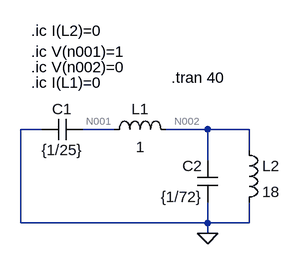
[diagram p0: schematic ej10.asc]
ej10.asc, the LTspice schematic file:
Version 4
SHEET 1 880 680
WIRE 80 176 48 176
WIRE 192 176 144 176
WIRE 336 176 272 176
WIRE 400 176 336 176
WIRE 400 208 400 176
WIRE 336 224 336 176
WIRE 48 320 48 176
WIRE 336 320 336 288
WIRE 336 320 48 320
WIRE 400 320 400 288
WIRE 400 320 336 320
WIRE 336 336 336 320
FLAG 336 336 0
SYMBOL ind 176 192 R270
WINDOW 0 32 56 VTop 2
WINDOW 3 5 56 VBottom 2
SYMATTR InstName L1
SYMATTR Value 1
SYMATTR SpiceLine Rser=0
SYMBOL cap 144 160 R90
WINDOW 0 0 32 VBottom 2
WINDOW 3 32 32 VTop 2
SYMATTR InstName C1
SYMATTR Value {1/25}
SYMBOL cap 352 288 R180
WINDOW 0 24 56 Left 2
WINDOW 3 24 8 Left 2
SYMATTR InstName C2
SYMATTR Value {1/72}
SYMBOL ind 384 192 R0
SYMATTR InstName L2
SYMATTR Value 18
SYMATTR SpiceLine Rser=0
TEXT 64 56 Left 2 !.ic V(n001)=1
TEXT 64 80 Left 2 !.ic V(n002)=0
TEXT 64 104 Left 2 !.ic I(L1)=0
TEXT 64 24 Left 2 !.ic I(L2)=0
TEXT 280 96 Left 2 !.tran 40

The netlist it stands for:
* ej10.asc
L1 N001 N002 1 Rser=0
C1 N001 0 {1/25}
C2 0 N002 {1/72}
L2 N002 0 18 Rser=0
.ic V(n001)=1
.ic V(n002)=0
.ic I(L1)=0
.ic I(L2)=0
.tran 40
.backanno
.end